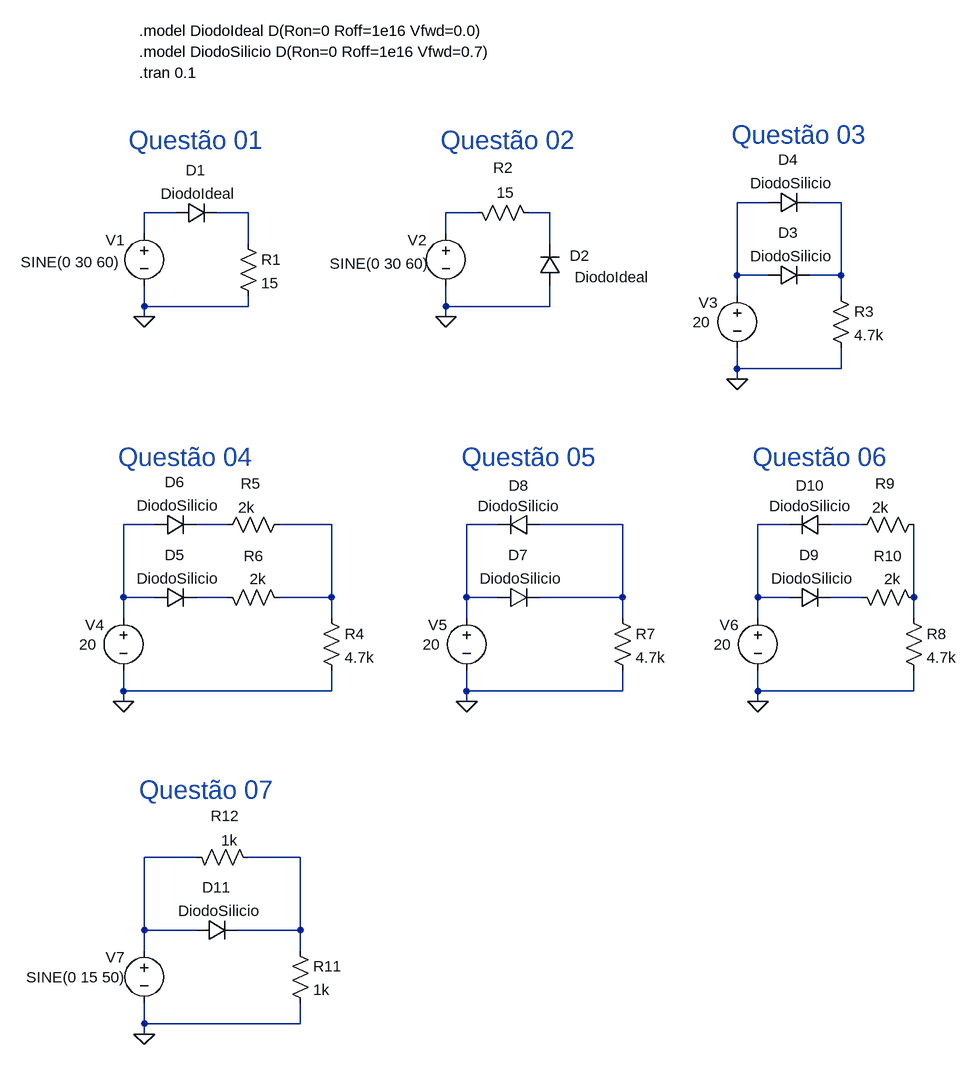
[diagram p0: schematic P1A08-Circuitos1-LTSpice.asc]
P1A08-Circuitos1-LTSpice.asc, the LTspice schematic file:
Version 4
SHEET 1 1436 1300
WIRE 992 0 944 0
WIRE 1104 0 1056 0
WIRE 80 16 32 16
WIRE 192 16 144 16
WIRE 544 16 496 16
WIRE 656 16 624 16
WIRE 32 48 32 16
WIRE 496 48 496 16
WIRE 192 64 192 16
WIRE 656 64 656 16
WIRE 944 112 944 0
WIRE 992 112 944 112
WIRE 1104 112 1104 0
WIRE 1104 112 1056 112
WIRE 944 144 944 112
WIRE 1104 144 1104 112
WIRE 32 160 32 128
WIRE 192 160 192 144
WIRE 192 160 32 160
WIRE 496 160 496 128
WIRE 656 160 656 128
WIRE 656 160 496 160
WIRE 32 176 32 160
WIRE 496 176 496 160
WIRE 944 256 944 224
WIRE 1104 256 1104 224
WIRE 1104 256 944 256
WIRE 944 272 944 256
WIRE 48 496 0 496
WIRE 160 496 112 496
WIRE 320 496 240 496
WIRE 576 496 528 496
WIRE 768 496 640 496
WIRE 1024 496 976 496
WIRE 1136 496 1088 496
WIRE 0 608 0 496
WIRE 48 608 0 608
WIRE 160 608 112 608
WIRE 320 608 320 496
WIRE 320 608 240 608
WIRE 528 608 528 496
WIRE 576 608 528 608
WIRE 768 608 768 496
WIRE 768 608 640 608
WIRE 976 608 976 496
WIRE 1024 608 976 608
WIRE 1136 608 1088 608
WIRE 1216 608 1216 496
WIRE 0 640 0 608
WIRE 320 640 320 608
WIRE 528 640 528 608
WIRE 768 640 768 608
WIRE 976 640 976 608
WIRE 1216 640 1216 608
WIRE 0 752 0 720
WIRE 320 752 320 720
WIRE 320 752 0 752
WIRE 528 752 528 720
WIRE 768 752 768 720
WIRE 768 752 528 752
WIRE 976 752 976 720
WIRE 1216 752 1216 720
WIRE 1216 752 976 752
WIRE 0 768 0 752
WIRE 528 768 528 752
WIRE 976 768 976 752
WIRE 112 1008 32 1008
WIRE 272 1008 192 1008
WIRE 32 1120 32 1008
WIRE 112 1120 32 1120
WIRE 272 1120 272 1008
WIRE 272 1120 176 1120
WIRE 32 1152 32 1120
WIRE 272 1152 272 1120
WIRE 32 1264 32 1232
WIRE 272 1264 272 1232
WIRE 272 1264 32 1264
WIRE 32 1280 32 1264
FLAG 32 176 0
FLAG 496 176 0
FLAG 944 272 0
FLAG 0 768 0
FLAG 528 768 0
FLAG 976 768 0
FLAG 32 1280 0
SYMBOL diode 80 32 R270
WINDOW 0 66 31 VTop 2
WINDOW 3 61 35 VBottom 2
SYMATTR InstName D1
SYMATTR Value DiodoIdeal
SYMBOL voltage 32 32 R0
WINDOW 123 0 0 Left 2
WINDOW 39 0 0 Left 2
WINDOW 0 -59 26 Left 2
WINDOW 3 -190 60 Left 2
SYMATTR InstName V1
SYMATTR Value SINE(0 30 60)
SYMBOL res 176 48 R0
SYMATTR InstName R1
SYMATTR Value 15
SYMBOL voltage 496 32 R0
WINDOW 123 0 0 Left 2
WINDOW 39 0 0 Left 2
WINDOW 0 -59 26 Left 2
WINDOW 3 -179 62 Left 2
SYMATTR InstName V2
SYMATTR Value SINE(0 30 60)
SYMBOL res 528 0 M90
WINDOW 0 -38 56 VBottom 2
WINDOW 3 -31 60 VTop 2
SYMATTR InstName R2
SYMATTR Value 15
SYMBOL diode 672 128 R180
WINDOW 0 -45 46 Left 2
WINDOW 3 -138 13 Left 2
SYMATTR InstName D2
SYMATTR Value DiodoIdeal
SYMBOL voltage 944 128 R0
WINDOW 123 0 0 Left 2
WINDOW 39 0 0 Left 2
WINDOW 0 -59 26 Left 2
WINDOW 3 -68 56 Left 2
SYMATTR InstName V3
SYMATTR Value 20
SYMBOL res 1088 128 R0
SYMATTR InstName R3
SYMATTR Value 4.7k
SYMBOL diode 992 128 R270
WINDOW 0 66 31 VTop 2
WINDOW 3 61 35 VBottom 2
SYMATTR InstName D3
SYMATTR Value DiodoSilicio
SYMBOL diode 992 16 R270
WINDOW 0 66 31 VTop 2
WINDOW 3 61 35 VBottom 2
SYMATTR InstName D4
SYMATTR Value DiodoSilicio
SYMBOL voltage 0 624 R0
WINDOW 123 0 0 Left 2
WINDOW 39 0 0 Left 2
WINDOW 0 -59 26 Left 2
WINDOW 3 -68 56 Left 2
SYMATTR InstName V4
SYMATTR Value 20
SYMBOL res 304 624 R0
SYMATTR InstName R4
SYMATTR Value 4.7k
SYMBOL diode 48 624 R270
WINDOW 0 66 31 VTop 2
WINDOW 3 61 35 VBottom 2
SYMATTR InstName D5
SYMATTR Value DiodoSilicio
SYMBOL diode 48 512 R270
WINDOW 0 66 31 VTop 2
WINDOW 3 61 35 VBottom 2
SYMATTR InstName D6
SYMATTR Value DiodoSilicio
SYMBOL res 256 480 R90
WINDOW 0 -32 60 VBottom 2
WINDOW 3 -26 67 VTop 2
SYMATTR InstName R5
SYMATTR Value 2k
SYMBOL res 144 592 M90
WINDOW 0 -32 56 VBottom 2
WINDOW 3 -28 63 VTop 2
SYMATTR InstName R6
SYMATTR Value 2k
SYMBOL voltage 528 624 R0
WINDOW 123 0 0 Left 2
WINDOW 39 0 0 Left 2
WINDOW 0 -59 26 Left 2
WINDOW 3 -68 56 Left 2
SYMATTR InstName V5
SYMATTR Value 20
SYMBOL res 752 624 R0
SYMATTR InstName R7
SYMATTR Value 4.7k
SYMBOL diode 576 624 R270
WINDOW 0 66 31 VTop 2
WINDOW 3 61 35 VBottom 2
SYMATTR InstName D7
SYMATTR Value DiodoSilicio
SYMBOL diode 640 480 R90
WINDOW 0 -29 32 VBottom 2
WINDOW 3 -28 32 VTop 2
SYMATTR InstName D8
SYMATTR Value DiodoSilicio
SYMBOL voltage 976 624 R0
WINDOW 123 0 0 Left 2
WINDOW 39 0 0 Left 2
WINDOW 0 -59 26 Left 2
WINDOW 3 -68 56 Left 2
SYMATTR InstName V6
SYMATTR Value 20
SYMBOL res 1200 624 R0
SYMATTR InstName R8
SYMATTR Value 4.7k
SYMBOL diode 1024 624 R270
WINDOW 0 66 31 VTop 2
WINDOW 3 61 35 VBottom 2
SYMATTR InstName D9
SYMATTR Value DiodoSilicio
SYMBOL diode 1088 480 R90
WINDOW 0 -29 32 VBottom 2
WINDOW 3 -28 32 VTop 2
SYMATTR InstName D10
SYMATTR Value DiodoSilicio
SYMBOL res 1232 480 R90
WINDOW 0 -32 60 VBottom 2
WINDOW 3 -26 67 VTop 2
SYMATTR InstName R9
SYMATTR Value 2k
SYMBOL res 1120 592 M90
WINDOW 0 -32 56 VBottom 2
WINDOW 3 -28 63 VTop 2
SYMATTR InstName R10
SYMATTR Value 2k
SYMBOL voltage 32 1136 R0
WINDOW 123 0 0 Left 2
WINDOW 39 0 0 Left 2
WINDOW 0 -59 26 Left 2
WINDOW 3 -182 57 Left 2
SYMATTR InstName V7
SYMATTR Value SINE(0 15 50)
SYMBOL res 256 1136 R0
SYMATTR InstName R11
SYMATTR Value 1k
SYMBOL diode 112 1136 R270
WINDOW 0 66 31 VTop 2
WINDOW 3 61 35 VBottom 2
SYMATTR InstName D11
SYMATTR Value DiodoSilicio
SYMBOL res 96 992 M90
WINDOW 0 -32 60 VBottom 2
WINDOW 3 -26 67 VTop 2
SYMATTR InstName R12
SYMATTR Value 1k
TEXT 24 -200 Left 2 !.tran 0.1
TEXT 24 -264 Left 2 !.model DiodoIdeal D(Ron=0 Roff=1e16 Vfwd=0.0)
TEXT 24 -232 Left 2 !.model DiodoSilicio D(Ron=0 Roff=1e16 Vfwd=0.7)
TEXT 8 -96 Left 4 ;Questão 01
TEXT 488 -96 Left 4 ;Questão 02
TEXT 936 -104 Left 4 ;Questão 03
TEXT -8 392 Left 4 ;Questão 04
TEXT 520 392 Left 4 ;Questão 05
TEXT 968 392 Left 4 ;Questão 06
TEXT 24 904 Left 4 ;Questão 07

The netlist it stands for:
* P1A08-Circuitos1-LTSpice.asc
D1 N003 N004 DiodoIdeal
V1 N003 0 SINE(0 30 60)
R1 N004 0 15
V2 N005 0 SINE(0 30 60)
R2 N005 N006 15
D2 0 N006 DiodoIdeal
V3 N001 0 20
R3 N002 0 4.7k
D3 N001 N002 DiodoSilicio
D4 N001 N002 DiodoSilicio
V4 N007 0 20
R4 N009 0 4.7k
D5 N007 N014 DiodoSilicio
D6 N007 N008 DiodoSilicio
R5 N009 N008 2k
R6 N014 N009 2k
V5 N010 0 20
R7 N011 0 4.7k
D7 N010 N011 DiodoSilicio
D8 N011 N010 DiodoSilicio
V6 N012 0 20
R8 N016 0 4.7k
D9 N012 N015 DiodoSilicio
D10 N013 N012 DiodoSilicio
R9 N016 N013 2k
R10 N015 N016 2k
V7 N017 0 SINE(0 15 50)
R11 N018 0 1k
D11 N017 N018 DiodoSilicio
R12 N017 N018 1k
.model D D
.lib standard.dio
.tran 0.1
.model DiodoIdeal D(Ron=0 Roff=1e16 Vfwd=0.0)
.model DiodoSilicio D(Ron=0 Roff=1e16 Vfwd=0.7)
* Questão 01
* Questão 02
* Questão 03
* Questão 04
* Questão 05
* Questão 06
* Questão 07
.backanno
.end